# Altium schematic sheet STM32F103Mini.SchDoc
size A4; SheetNumber: 1; SheetTotal: 1
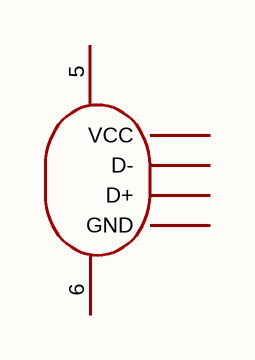
[diagram p0: STM32F103Mini.SchDoc]

## Parts
CN?  USB-B-Female-90  (value not drawn)

## Nets

Not connected (* = marked no-connect by the designer): CN? 1(VCC) 2(D-) 3(D+) 4(GND) 5(SH1) 6(SH2)

## Library data of the parts
CN? = USB-B-Female-90: Symbol: USB-B-Female-90